# EasyEDA schematic EasyEDA_spot-welder.json
TITLE: DIY Spot Welder; REV: 1.0; Date: 13th Sept 2022; Sheet: 1/1; Drawn By: kabadisha
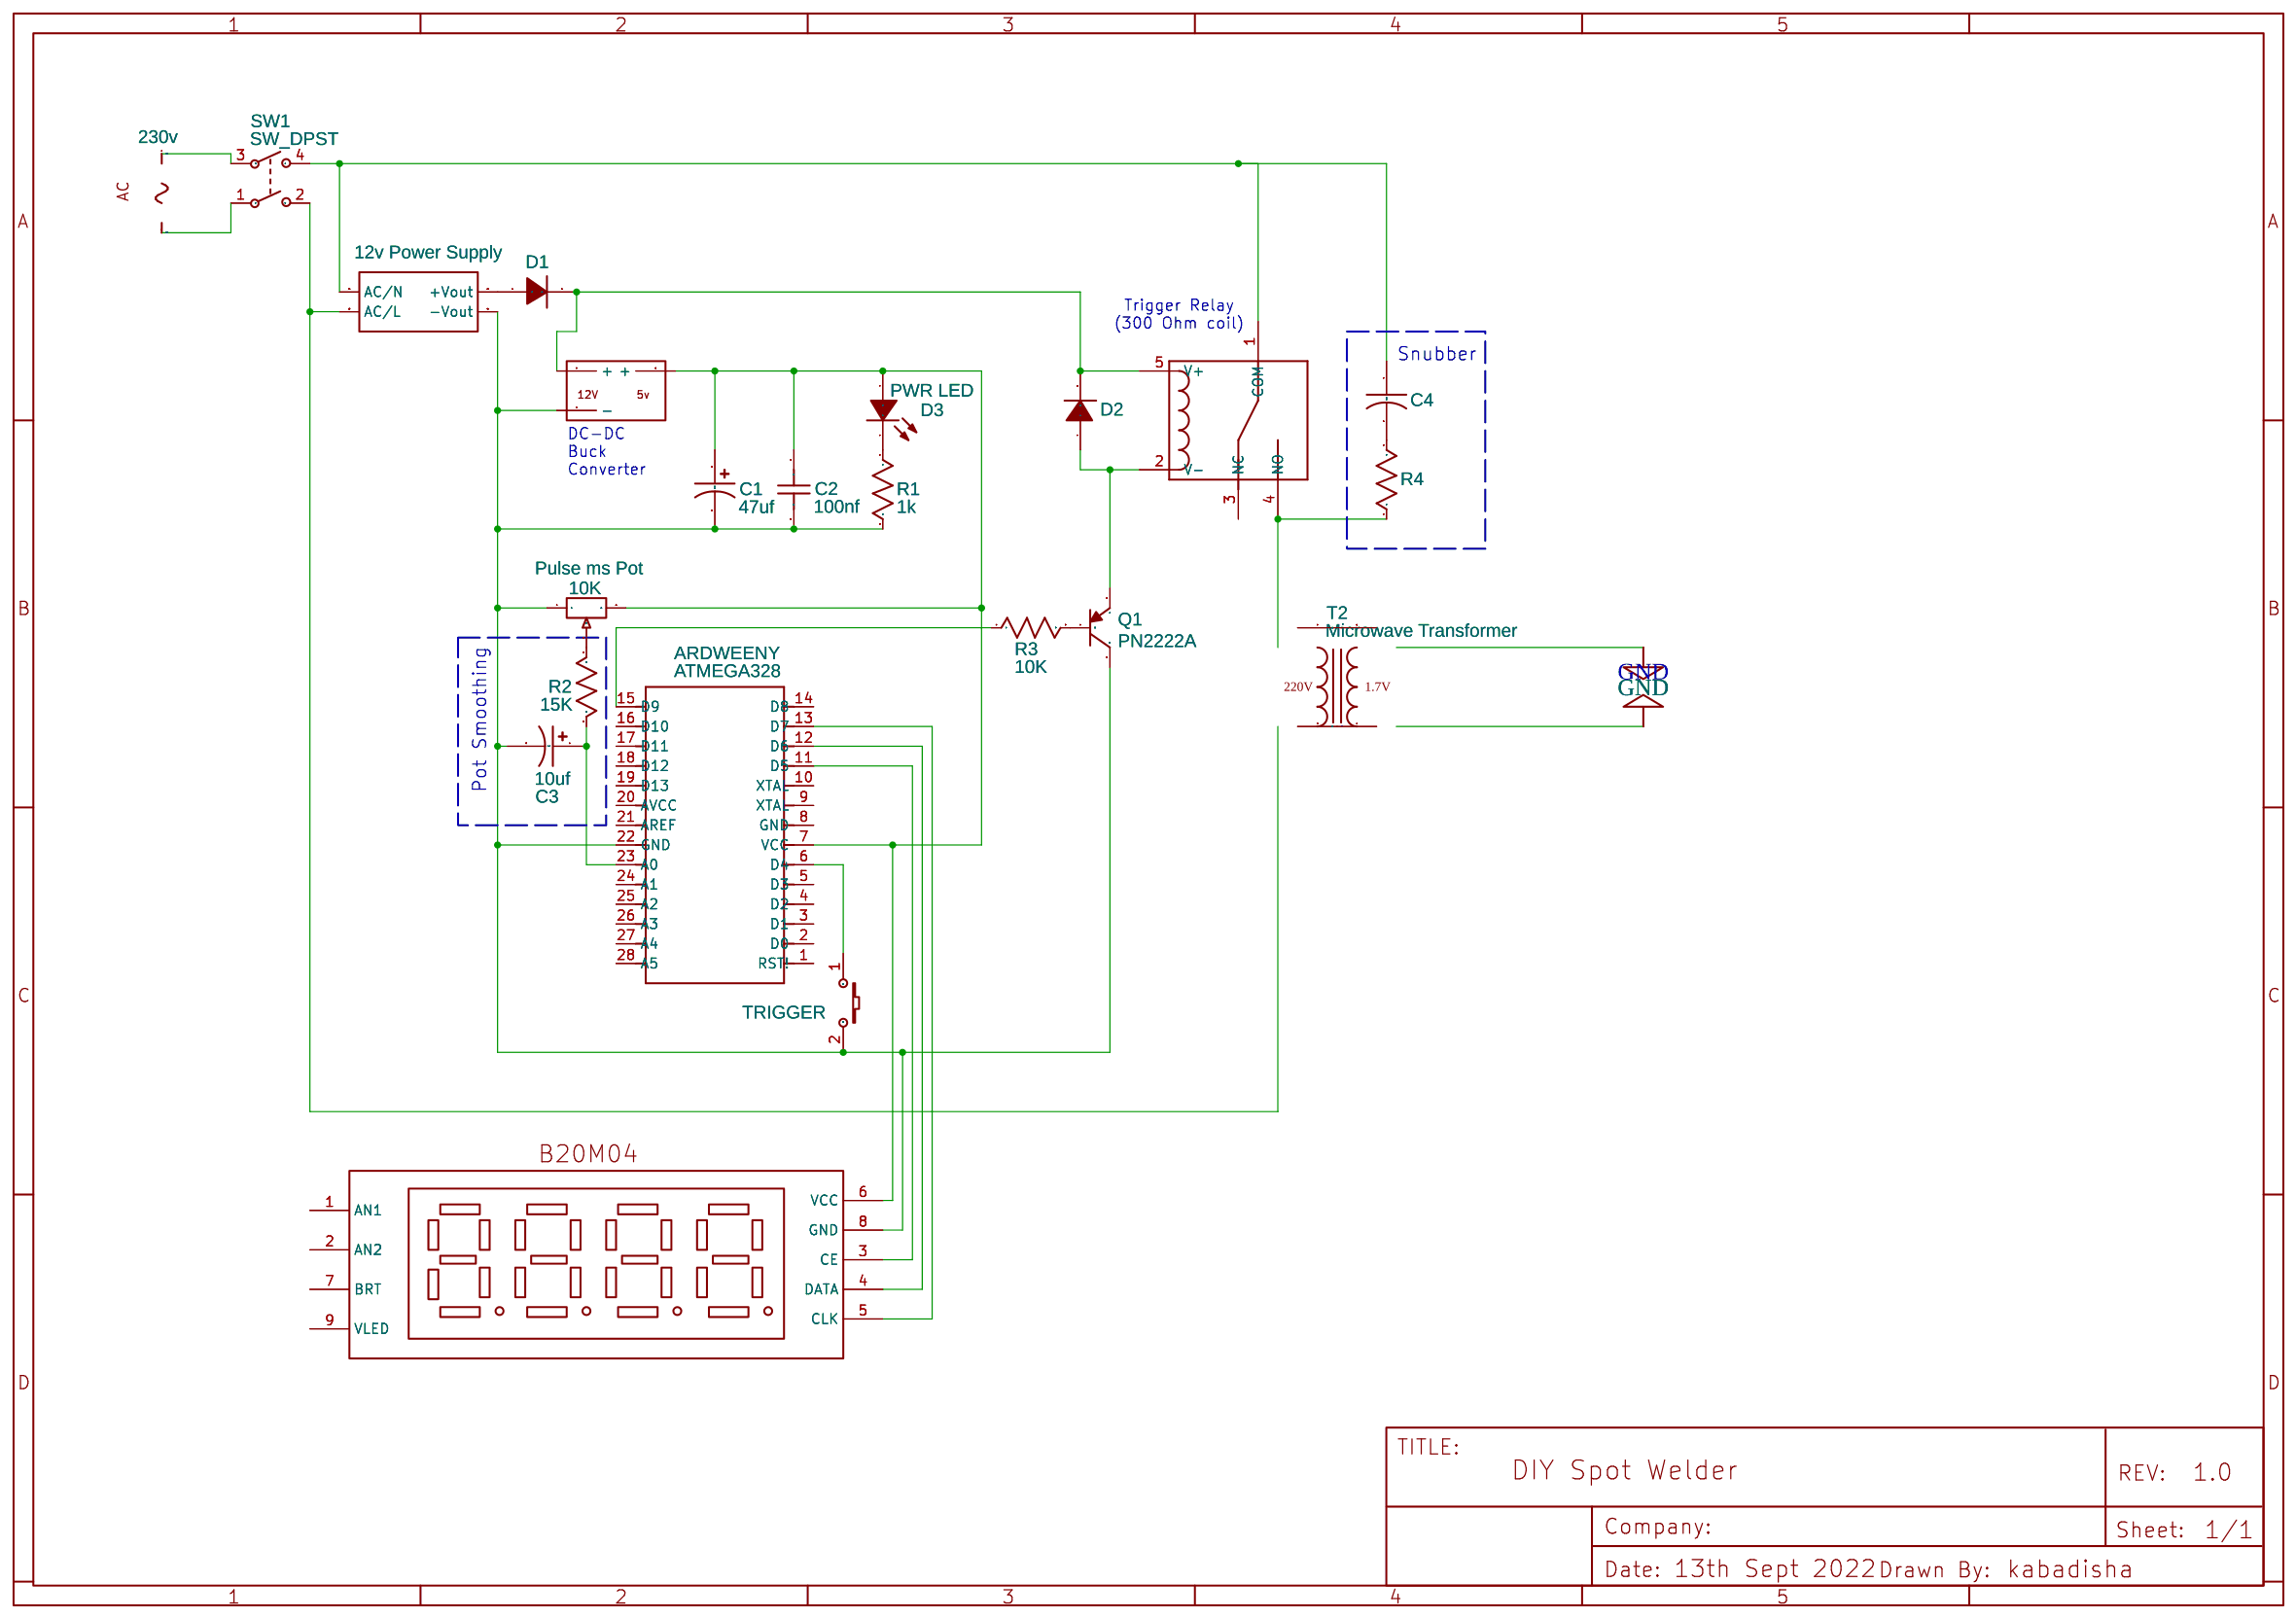
[diagram p0: schematic sheet]

## Parts
10K  Pulse ms Pot  [RES-ADJ-TH_3386P]
AC_1  230v  [AC]
ARDWEENY  ATMEGA328  [DIP28-2.54-35.6X13.5MM]
C1  47uf  [CASE-A_3216]
C2  100nf  [C0603]
C3  10uf  [CASE-A_3216]
C4  4700uf  [CP_8X13MM]
D1  1N4001  [DO35-7]
D2  1N4001  [DO35-7]
D3  PWR LED  [LED3MM]
K1  12V Trigger Relay  [RELAY _12VDC_10A-TIANBO-HJR-3FF-S-Z-12VDC]
NO  12v Power Supply
Q1  PN2222A  [SOT23]
Q2  DC-DC  [BUCK_DC-DCB]
R1  1k  [R3]
R2  15K  [R3]
R3  10K  [R3]
R4  100  [R3]
SW1  SW_DPST
T2  Microwave Transformer  [12V TRANSFORMER]
TRIGGER  K2-3.6×6.1_SMD  [KEY-SMD_2P-L6.2-W3.6-LS8.0]
U1  B20M04-4DIGITS-7SEGMENTS-DISPLAY  [4DIGITS-7SEGMENTS-DISPLAY-TM1637]

## Library data of the parts
10K = R_3386P_EU: Supplier: LCSC; Contributor: LCEDA_Lib
AC_1 = AC: Contributor: brithney2002
ARDWEENY = -: IC MCU 8Bit 32KB ISP flash 20MHz  1.8v-5.5v; catid: 20; sourceId: F4YSasKEW; Supplier: SeeedStudio; Manufacturer Part: ATMEGA328P-PU; Supplier Part: 310010051
C1 C3 = C_Tan_SMD_A_US: Contributor: LCEDA_Lib
C2 = C_0603_US: Contributor: LCEDA_Lib
C4 = Capacitor: Manufacturer Part: ?
D1 D2 = Diode: Manufacturer Part: ?
D3 = LED: Manufacturer Part: ?
K1 = 12V 5PIN DC RELAY: Supplier Part: A-1016; Supplier: Tayda; Manufacturer Part: HJR-3FF-S-Z-12VDC; sourceId: 2JH31nkGE; Manufacturer: TIANBO; Contributor: Elavarasi
NO = TMP 15105C: AC / DC converter; Contributor: jogagua; Supplier: RS-Online; Supplier Part: 664-1461; Manufacturer: TRACOPOWER
Q1 = PNP: Manufacturer Part: ?
Q2 = DC-DC: Manufacturer: Nexperia; Manufacturer Part: BUK7M12-60EX; Contributor: mjutras; Supplier Part: C179349
R1-R4 = Resistor: Manufacturer Part: ?
SW1 = SW_DPST: Contributor: KiCAD; license: https://www.gnu.org/licenses/lgpl-2.1.html
T2 = TRANSFORMER - 12V: Contributor: sohaibpannu
TRIGGER = K2-3.6×6.1_SMD: Supplier Part: C118141; Supplier: LCSC; Manufacturer Part: K2-1107ST-A4SW-06; Contributor: LCEDA_Lib; 制造商: 韩国韩荣
U1 = B20M04-4DIGITS-7SEGMENTS-DISPLAY: Manufacturer: Nexus Machines; Manufacturer Part: B20M04; link: https://www.farnell.com/datasheets/29061.pdf; Contributor: kabadisha

## Nets
GND: T2.3 T2.4
Net-(10K-1): 10K.1 ARDWEENY.22(GND) C1.2 C2.2 C3.2 NO.-Vout Q1.3(C) Q2.1(-) R1.2 TRIGGER.2 U1.8(GND)
Net-(10K-2): 10K.2 R2.1
Net-(10K-3): 10K.3 ARDWEENY.7(VCC) C1.1 C2.1 D3.A Q2.3(+) U1.6(VCC)
Net-(AC_1-A): AC_1.A(ANODE) SW1.3
Net-(AC_1-C): AC_1.C(CATHODE) SW1.1
Net-(ARDWEENY-6): ARDWEENY.6(D4) TRIGGER.1
Net-(ARDWEENY-11): ARDWEENY.11(D5) U1.3(CE)
Net-(ARDWEENY-12): ARDWEENY.12(D6) U1.4(DATA)
Net-(ARDWEENY-13): ARDWEENY.13(D7) U1.5(CLK)
Net-(ARDWEENY-15): ARDWEENY.15(D9) R3.1
Net-(ARDWEENY-23): ARDWEENY.23(A0) C3.1 R2.2
Net-(C4-1): C4.1 K1.1(COM) NO.AC/N SW1.4
Net-(C4-2): C4.2 R4.2
Net-(D1-A): D1.A NO.+Vout
Net-(D1-C): D1.C D2.C K1.5(V+) Q2.W(+)
Net-(D2-A): D2.A K1.2(V-) Q1.2(E)
Net-(D3-K): D3.K R1.1
Net-(K1-4): K1.4(NO) R4.1 T2.1(1 )
Net-(NO-AC/L): NO.AC/L SW1.2 T2.2(2 )
Net-(Q1-1): Q1.1(B) R3.2

Not connected (* = marked no-connect by the designer): ARDWEENY 1(RST!) 2(D0) 3(D1) 4(D2) 5(D3) 8(GND) 9(XTAL) 10(XTAL) 14(D8) 16(D10) 17(D11) 18(D12) 19(D13) 20(AVCC) 21(AREF) 24(A1) 25(A2) 26(A3) 27(A4) 28(A5); K1 3(NC); U1 1(AN1) 2(AN2) 7(BRT) 9(VLED)

## Notes on the sheet
- Trigger Relay
  (300 Ohm coil)
- Snubber
- DC-DC
  Buck
  Converter
- Pot Smoothing
